# EAGLE design h-bridge_0.6 (EAGLE 8.0.0)

## Sheet 1 of 2
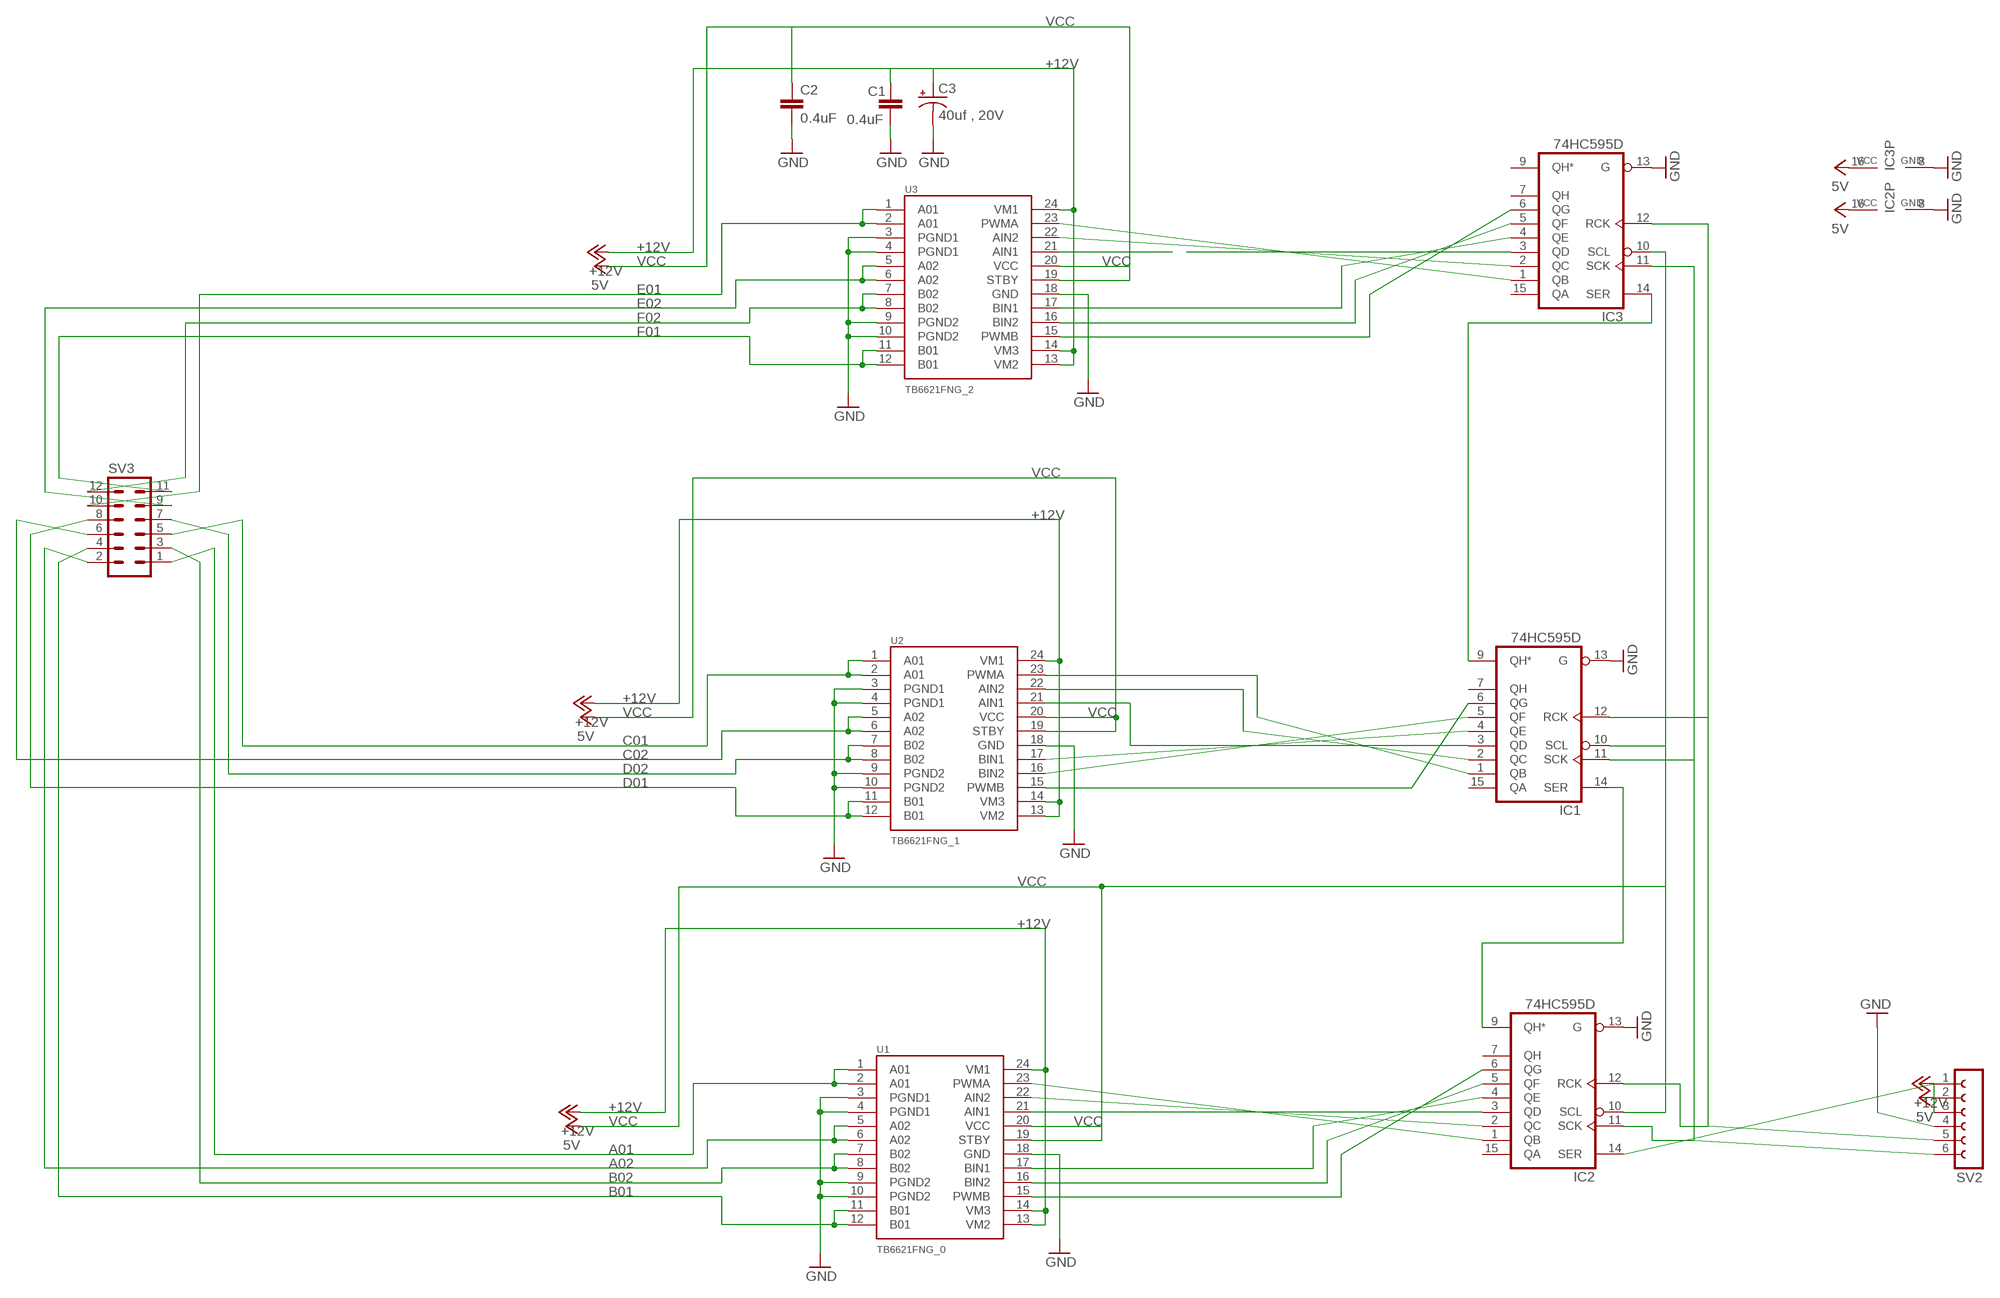
[diagram p0: schematic, sheet 1]

### Parts
C1  0.4uF  CAP0402-CAP  [0402-CAP]
C2  0.4uF  CAP0402-CAP  [0402-CAP]
C3  40uf , 20V  CAP_POL3528  [EIA3528]
IC1  74HC595D  [SO16]
IC2  74HC595D  [SO16]
IC3  74HC595D  [SO16]
SV2  FE06-1  [FE06]
SV3  MA06-2  [MA06-2]
U1  TB6621FNG_0  TB6621FNG  [SSOP24]
U2  TB6621FNG_1  TB6621FNG  [SSOP24]
U3  TB6621FNG_2  TB6621FNG  [SSOP24]

### Nets
+12V: C1.1 C3.A(+) SV2.2 U1.13(VM2) U1.14(VM3) U1.24(VM1) U2.13(VM2) U2.14(VM3) U2.24(VM1) U3.13(VM2) U3.14(VM3) U3.24(VM1)
A01: SV3.1 U1.1(A01) U1.2(A01)
A02: SV3.2 U1.5(A02) U1.6(A02)
B01: SV3.4 U1.11(B01) U1.12(B01)
B02: SV3.3 U1.7(B02) U1.8(B02)
C01: SV3.5 U2.1(A01) U2.2(A01)
C02: SV3.6 U2.5(A02) U2.6(A02)
D01: SV3.8 U2.11(B01) U2.12(B01)
D02: SV3.7 U2.7(B02) U2.8(B02)
E01: SV3.10 U3.1(A01) U3.2(A01)
E02: SV3.9 U3.5(A02) U3.6(A02)
F01: SV3.11 U3.11(B01) U3.12(B01)
F02: SV3.12 U3.7(B02) U3.8(B02)
GND: C1.2 C2.2 C3.C(-) IC1.13(G) IC2.8(GND) IC2.13(G) IC3.8(GND) IC3.13(G) SV2.4 U1.3(PGND1) U1.4(PGND1) U1.9(PGND2) U1.10(PGND2) U1.18(GND) U2.3(PGND1) U2.4(PGND1) U2.9(PGND2) U2.10(PGND2) U2.18(GND) U3.3(PGND1) U3.4(PGND1) U3.9(PGND2) U3.10(PGND2) U3.18(GND)
N$1: IC2.5(QF) U1.16(BIN2)
N$2: IC3.5(QF) U3.16(BIN2)
N$3: IC2.2(QC) U1.22(AIN2)
N$4: IC3.4(QE) U3.17(BIN1)
N$5: IC2.6(QG) U1.15(PWMB)
N$6: IC2.1(QB) U1.23(PWMA)
N$7: IC1.11(SCK) IC2.11(SCK) IC3.11(SCK) SV2.6
N$8: IC2.14(SER) SV2.1
N$9: IC1.12(RCK) IC2.12(RCK) IC3.12(RCK) SV2.5
N$10: IC1.14(SER) IC2.9(QH*)
N$11: IC2.4(QE) U1.17(BIN1)
N$12: IC1.6(QG) U2.15(PWMB)
N$13: IC2.3(QD) U1.21(AIN1)
N$14: IC1.5(QF) U2.16(BIN2)
N$15: IC1.4(QE) U2.17(BIN1)
N$16: IC1.3(QD) U2.21(AIN1)
N$17: IC1.2(QC) U2.22(AIN2)
N$18: IC1.9(QH*) IC3.14(SER)
N$19: IC1.1(QB) U2.23(PWMA)
N$20: IC3.3(QD)
N$21: IC3.6(QG) U3.15(PWMB)
N$22: IC3.2(QC) U3.22(AIN2)
N$23: U3.21(AIN1)
N$24: IC3.1(QB) U3.23(PWMA)
VCC: C2.1 IC1.10(SCL) IC2.10(SCL) IC2.16(VCC) IC3.10(SCL) IC3.16(VCC) SV2.3 U1.19(STBY) U1.20(VCC) U2.19(STBY) U2.20(VCC) U3.19(STBY) U3.20(VCC) ; supply symbol labelled 5V
Unconnected: IC1.7(QH) IC1.15(QA) IC2.7(QH) IC2.15(QA) IC3.7(QH) IC3.9(QH*) IC3.15(QA)

## Sheet 2 of 2

## Power pins joined to a net without a drawn wire
GND: IC1.8(GND)
VCC: IC1.16(VCC)

## Library data of the parts
C1 C2 = SparkFun:CAP: Capacitor Standard 0603 ceramic capacitor, and 0.1" leaded capacitor.
C3 = SparkFun:CAP_POL: Capacitor Polarized These are standard SMD and PTH capacitors. Normally 10uF, 47uF, and 100uF in electrolytic and tantalum varieties. Always verify the external diameter of the through hole cap, it varies with capacity, voltage, and manufacturer. The EIA devices should be standard.
IC1-IC3 = 74xx-eu:74*595: 8-bit SHIFT REGISTER, output latch
SV2 = con-lsta:FE06-1: FEMALE HEADER; OC_FARNELL: unknown; OC_NEWARK: unknown
SV3 = con-lstb:MA06-2: PIN HEADER; OC_FARNELL: unknown; OC_NEWARK: unknown
U1-U3 = SparkFun:TB6621FNG: Toshiba 1A motor driver

## Board
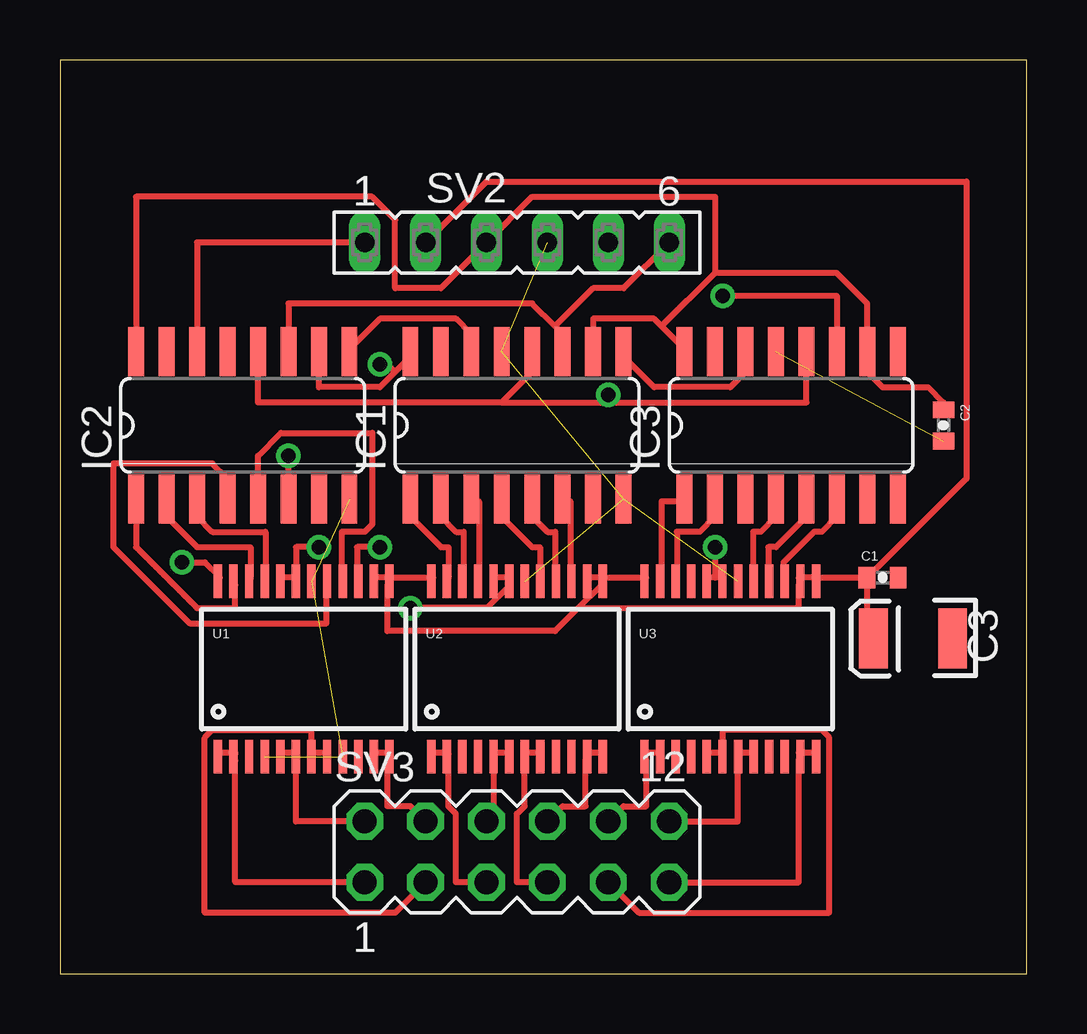
[diagram p1: board, top side]
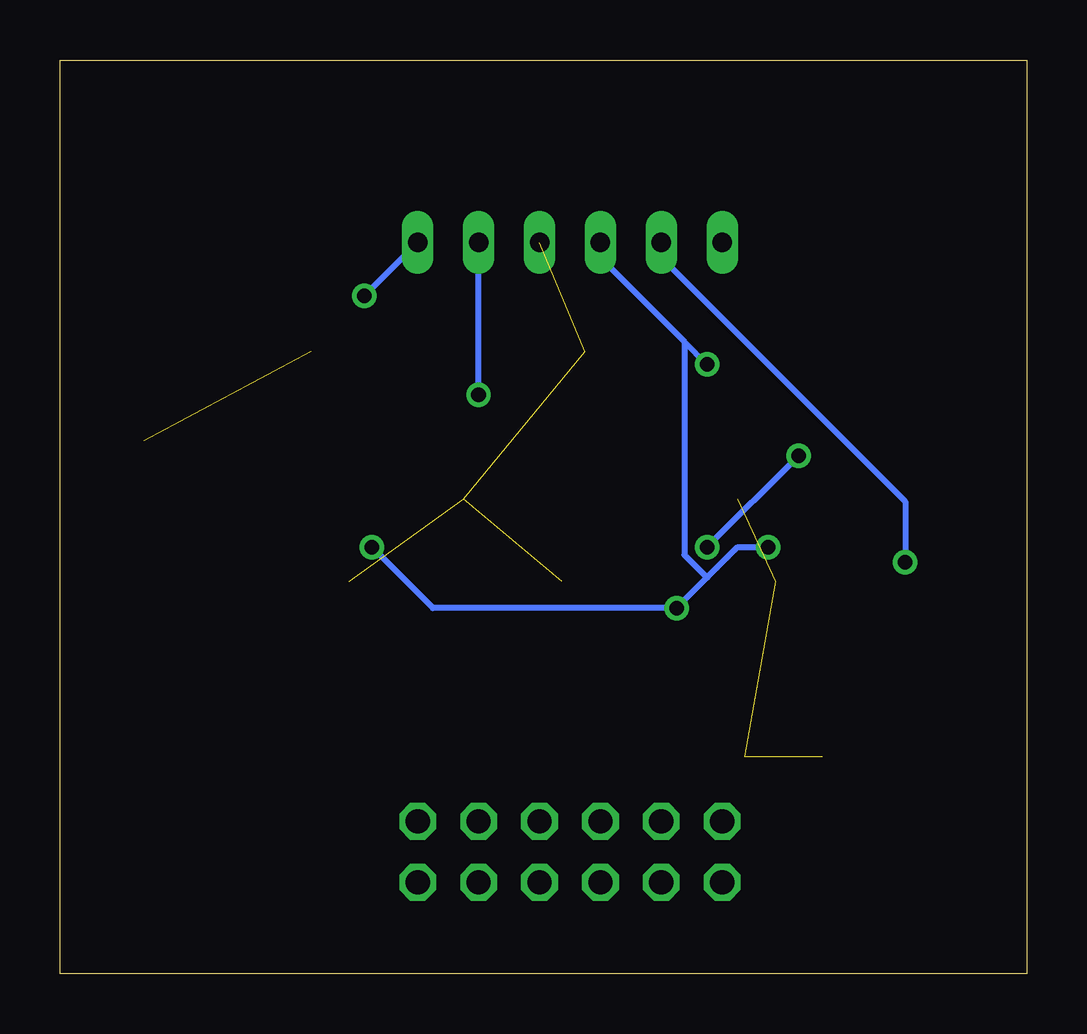
[diagram p2: board, bottom side, seen from below]

Size 40.31 x 38.09 mm. Coordinates in mm from the lower left corner, seen from the top.
Outline: 0,0 40.31,0 40.31,38.09 0,38.09 0,0
Copper layers (1*16): Top 0.035mm / dielectric 1.5mm / Bottom 0.035mm
Design rules "default *": minimum track width 10mil, minimum drill 10mm, track to track 8mil, track to pad 8mil, pad to pad 8mil, via to via 8mil, smd to smd 8mil, copper to edge 40mil, drill to drill 8mil, minimum pad ring 10mil, minimum via ring 8mil, stop-mask expansion 4mil, vias tented up to drill 0mil, thermal gap 10mil

### Footprints (pad centres in the part's own frame; a part is rotated, then mirrored left to right if it is on the bottom)
0402-CAP = smd 0.7 x 0.9: 1 -0.65,0; 2 0.65,0
EIA3528 = smd 1.2 x 2.5: A 1.65,0; C -1.65,0
SO16 = smd 0.66 x 2.032: 1 -4.445,-3.073; 2 -3.175,-3.073; 3 -1.905,-3.073; 4 -0.635,-3.073; 5 0.635,-3.073; 6 1.905,-3.073; 7 3.175,-3.073; 8 4.445,-3.073; 9 4.445,3.073; 10 3.175,3.073; 11 1.905,3.073; 12 0.635,3.073; 13 -0.635,3.073; 14 -1.905,3.073; 15 -3.175,3.073; 16 -4.445,3.073
FE06 = drill 0.813 long: 1 -6.35,0; 2 -3.81,0; 3 -1.27,0; 4 1.27,0; 5 3.81,0; 6 6.35,0
MA06-2 = drill 1.016 octagon: 1 -6.35,-1.27; 2 -6.35,1.27; 3 -3.81,-1.27; 4 -3.81,1.27; 5 -1.27,-1.27; 6 -1.27,1.27; 7 1.27,-1.27; 8 1.27,1.27; 9 3.81,-1.27; 10 3.81,1.27; 11 6.35,-1.27; 12 6.35,1.27
SSOP24 = smd 0.348 x 1.397: 1 -3.575,-3.656; 2 -2.925,-3.656; 3 -2.275,-3.656; 4 -1.625,-3.656; 5 -0.975,-3.656; 6 -0.325,-3.656; 7 0.325,-3.656; 8 0.975,-3.656; 9 1.625,-3.656; 10 2.275,-3.656; 11 2.925,-3.656; 12 3.575,-3.656; 13 3.575,3.656; 14 2.925,3.656; 15 2.275,3.656; 16 1.625,3.656; 17 0.975,3.656; 18 0.325,3.656; 19 -0.325,3.656; 20 -0.975,3.656; 21 -1.625,3.656; 22 -2.275,3.656; 23 -2.925,3.656; 24 -3.575,3.656

### Placement (x,y rotation side)
C1  34.29,16.51 0 top
C2  36.83,22.86 270 top
C3  35.56,13.97 180 top
IC1  19.05,22.86 0 top
IC2  7.62,22.86 0 top
IC3  30.48,22.86 0 top
SV2  19.05,30.48 0 top
SV3  19.05,5.08 0 top
U1  10.16,12.7 0 top
U2  19.05,12.7 0 top
U3  27.94,12.7 0 top

### Tracks (layer width: path | path; a pad name or v marks a point on that pad's centre or on a via)
+12V  (via drill 0.61)
  Top 0.254: 31.43,16.51 C1.1 33.66,16.51 | 31.43,16.51 30.8,16.51 U3.14 30.8,16.19 30.8,15.24 21.59,15.24 | 31.43,16.51 U3.13 | 33.66,16.51 33.66,13.97 C3.A | 13.65,16.51 13.02,16.51 U1.14 | 13.65,16.51 15.56,16.51 U2.24 | 13.65,16.51 U1.13 13.65,16.19 13.65,14.29 20.64,14.29 21.59,15.24 | 22.54,16.51 21.91,16.51 U2.14 | 22.54,16.51 24.45,16.51 U3.24 | 22.54,16.51 U2.13 22.54,16.19 21.59,15.24 | v5.08,17.14 6.03,17.14 6.67,16.51 U1.24 | 33.66,16.51 37.78,20.64 37.78,33.02 17.78,33.02 SV2.2
  Bottom 0.254: v5.08,17.14 5.08,19.68 15.24,29.84 SV2.2
A01
  Top 0.254: U1.1 6.67,9.21 7.3,9.21 U1.2 7.3,8.89 7.3,3.81 SV3.1
A02
  Top 0.254: U1.5 9.21,9.21 9.84,9.21 U1.6 9.84,8.89 9.84,6.35 SV3.2
B01
  Top 0.254: U1.11 13.02,9.21 13.65,9.21 U1.12 13.65,8.89 13.65,6.99 14.61,6.99 SV3.4
B02
  Top 0.254: 10.48,9.21 11.11,9.21 U1.8 | 10.48,9.21 10.48,10.16 6.35,10.16 6.03,9.84 6.03,2.54 13.97,2.54 SV3.3 | 10.48,9.21 U1.7
C01
  Top 0.254: U2.1 15.56,9.21 16.19,9.21 U2.2 16.19,8.89 16.19,6.99 16.51,6.67 16.51,3.81 SV3.5
C02
  Top 0.254: U2.6 18.73,9.21 18.1,9.21 U2.5 18.1,8.89 18.1,6.35 SV3.6
D01
  Top 0.254: U2.12 22.54,9.21 21.91,9.21 U2.11 21.91,8.89 21.91,6.99 20.95,6.99 SV3.8
D02
  Top 0.254: U2.8 20,9.21 19.37,9.21 U2.7 19.37,8.89 19.37,6.99 19.05,6.67 19.05,3.81 SV3.7
E01
  Top 0.254: U3.2 25.08,9.21 24.45,9.21 U3.1 24.45,8.89 24.45,6.99 23.5,6.99 SV3.10
E02
  Top 0.254: 27.62,9.21 26.99,9.21 U3.5 | 27.62,9.21 27.62,10.16 31.75,10.16 32.07,9.84 32.07,2.54 24.13,2.54 SV3.9 | 27.62,9.21 U3.6
F01
  Top 0.254: U3.12 31.43,9.21 30.8,9.21 U3.11 30.8,8.89 30.8,3.81 SV3.11
F02
  Top 0.254: U3.8 28.89,9.21 28.26,9.21 U3.7 28.26,8.89 28.26,6.35 SV3.12
GND  (8 unrouted)
N$1
  Top 0.254: IC2.5 8.26,21.59 9.21,22.54 13.02,22.54 13.02,18.73 12.7,18.41 11.75,18.41 11.75,16.51 U1.16
N$2
  Top 0.254: IC3.5 31.11,19.05 29.84,17.78 29.53,17.78 29.53,16.51 U3.16
N$3
  Top 0.254: IC2.2 4.45,19.05 5.71,17.78 7.94,17.78 7.94,16.51 U1.22
N$4
  Top 0.254: IC3.4 29.84,19.05 29.21,18.41 28.89,18.41 28.89,16.51 U3.17
N$5  (via drill 0.61)
  Top 0.254: v13.34,17.78 12.38,17.78 12.38,16.51 U1.15 | IC2.6 v9.53,21.59
  Bottom 0.254: v9.53,21.59 v13.34,17.78
N$6
  Top 0.254: IC2.1 3.17,17.78 5.71,15.24 7.3,15.24 7.3,16.19 U1.23
N$7  (via drill 0.61)
  Top 0.254: IC2.11 9.53,27.94 19.68,27.94 20.64,26.99 | 20.64,26.99 20.95,26.67 IC1.11 | IC3.11 32.38,28.26 v27.62,28.26 | 20.64,26.99 22.23,28.57 23.5,28.57 SV2.6
  Bottom 0.254: SV2.6 v27.62,28.26
N$8
  Top 0.254: IC2.14 5.71,30.48 SV2.1
N$9  (via drill 0.61)
  Top 0.254: IC2.12 8.26,23.81 18.41,23.81 | 18.41,23.81 19.68,25.08 IC1.12 | IC3.12 31.11,23.81 22.86,23.81 | 18.41,23.81 22.86,23.81 | 22.86,23.81 v22.86,24.13
  Bottom 0.254: v22.86,24.13 SV2.5
N$10
  Top 0.254: IC1.14 17.14,26.67 16.51,27.3 13.34,27.3 12.06,26.04 IC2.9
N$11
  Top 0.254: IC2.4 6.99,20.64 6.35,21.27 2.22,21.27 2.22,17.78 5.4,14.61 11.11,14.61 11.11,16.19 U1.17
N$12
  Top 0.254: U2.15 21.27,16.51 21.27,19.68 20.95,19.68 IC1.6
N$13
  Top 0.254: IC2.3 5.71,19.05 6.35,18.41 8.57,18.41 8.57,16.51 U1.21
N$14
  Top 0.254: IC1.5 19.68,19.05 20.32,18.41 20.64,18.41 20.64,16.51 U2.16
N$15
  Top 0.254: IC1.4 18.41,19.05 19.68,17.78 20,17.78 20,16.51 U2.17
N$16
  Top 0.254: U2.21 17.46,16.51 17.46,19.68 17.14,19.68 IC1.3
N$17
  Top 0.254: IC1.2 15.88,19.05 16.51,18.41 16.83,18.41 16.83,16.51 U2.22
N$18
  Top 0.254: IC3.14 28.57,25.08 27.94,24.45 24.77,24.45 23.5,25.72 IC1.9
N$19
  Top 0.254: IC1.1 14.61,19.05 15.88,17.78 16.19,17.78 16.19,16.51 U2.23
N$21
  Top 0.254: IC3.6 32.38,19.05 31.75,18.41 31.43,18.41 30.16,17.14 30.16,16.51 U3.15
N$22
  Top 0.254: IC3.2 27.3,19.05 26.67,18.41 25.72,18.41 25.72,16.51 U3.22
N$24
  Top 0.254: U3.23 25.08,16.51 25.08,19.68 26.04,19.68 IC3.1
VCC  (via drill 0.61)
  Top 0.254: 27.3,16.51 27.62,16.51 U3.19 | 27.3,16.51 26.99,16.51 U3.20 | 9.84,16.51 9.21,16.51 U1.20 | U2.20 18.1,16.51 18.73,16.51 U2.19 18.73,16.19 17.78,15.24 v14.61,15.24 | 9.84,16.51 9.84,17.78 v10.79,17.78 | 9.84,16.51 U1.19 | v27.3,17.78 27.3,16.51 | IC1.10 22.23,27.3 24.77,27.3 25.08,26.99 | 25.08,26.99 26.04,26.04 IC3.16 | C2.1 36.83,23.81 36.2,24.45 34.29,24.45 33.66,25.08 IC3.10 33.66,27.94 32.38,29.21 27.3,29.21 | 27.3,29.21 25.08,26.99 | IC2.10 10.79,24.45 13.34,24.45 13.97,25.08 | 13.97,25.08 14.61,25.72 IC1.16 | IC2.16 3.17,32.38 13.02,32.38 13.97,31.43 13.97,28.57 15.88,28.57 SV2.3 19.68,32.38 27.3,32.38 27.3,29.21 | 13.97,25.08 13.65,25.4 v13.34,25.4
  Bottom 0.254: v10.79,17.78 12.06,17.78 13.34,16.51 | 13.34,16.51 v14.61,15.24 24.77,15.24 v27.3,17.78 | 14.29,26.35 17.78,29.84 SV2.3 | 14.29,26.35 v13.34,25.4 | 13.34,16.51 14.29,17.46 14.29,26.35